# EAGLE design MotorDriver (EAGLE 6.0)
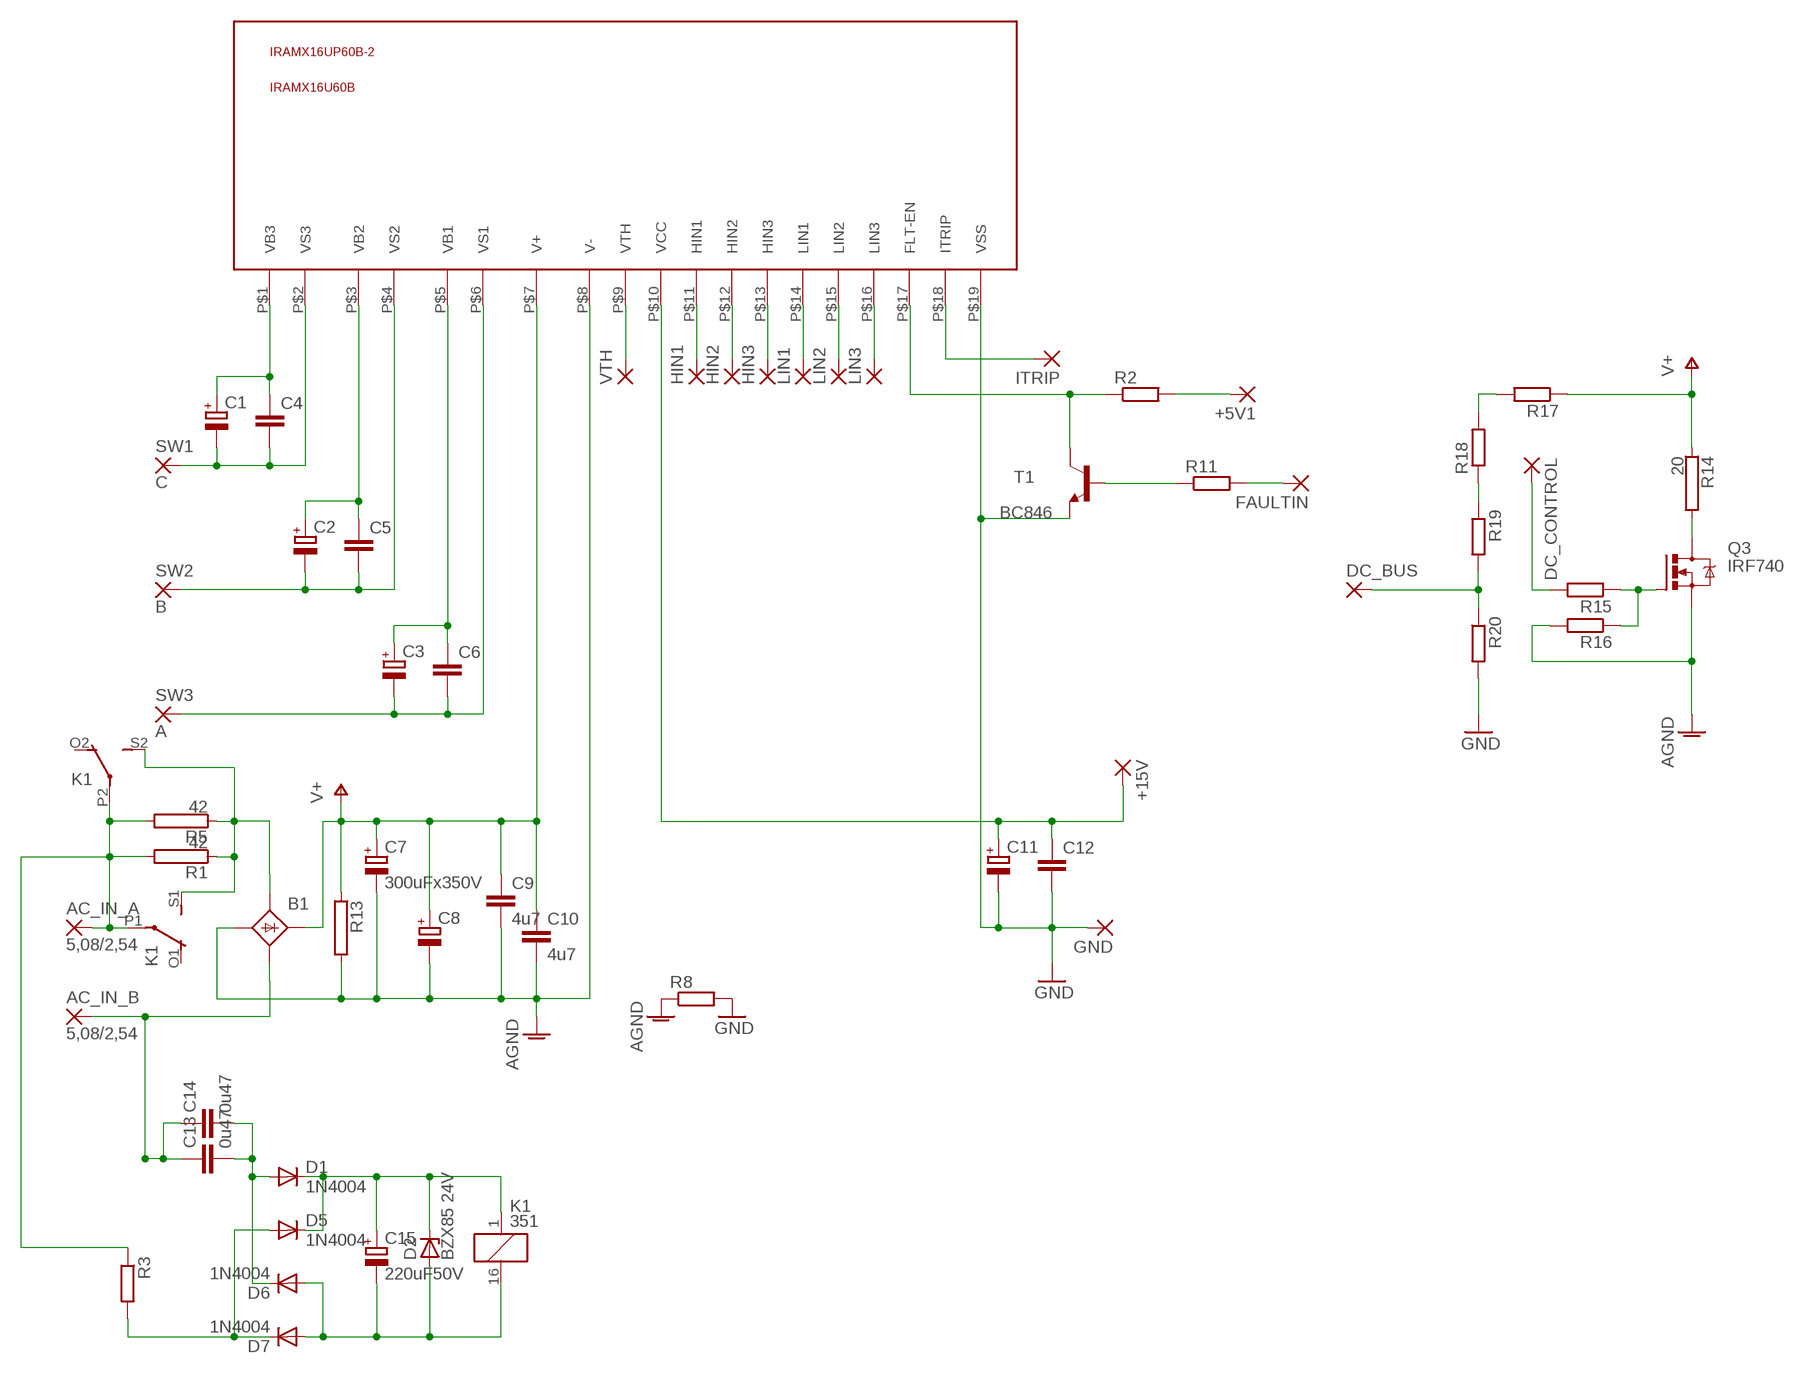
[diagram p0: schematic, sheet 1]

## Parts
+5V1  3,81/1,3  [3,81/1,3]
+15V  3,81/1,3  [3,81/1,3]
AC_IN_A  5,08/2,54  [5,08/2,54]
AC_IN_B  5,08/2,54  [5,08/2,54]
B1  B25A-  [B25A-]
C1  CPOL-EUE2,5-6E  [E2,5-6E]
C2  CPOL-EUE2,5-6E  [E2,5-6E]
C3  CPOL-EUE2,5-6E  [E2,5-6E]
C4  C-EUC1206  [C1206]
C5  C-EUC1206  [C1206]
C6  C-EUC1206  [C1206]
C7  300uFx350V  CPOL-EUE10-35  [EB35D]
C8  CPOL-EUE10-35  [EB35D]
C9  4u7  C-EU225-074X268  [C225-074X268]
C10  4u7  C-EU225-074X268  [C225-074X268]
C11  CPOL-EUE2,5-6E  [E2,5-6E]
C12  C-EUC1206  [C1206]
C13  0u47  C-EU102-064X133  [C102-064X133]
C14  0u47  C-EU102-064X133  [C102-064X133]
C15  220uF50V  CPOL-EUE3.5-10  [E3,5-10]
D1  1N4004  [DO41-10]
D2  BZX85 24V  BZX85  [DO41Z10]
D5  1N4004  [DO41-10]
D6  1N4004  [DO41-10]
D7  1N4004  [DO41-10]
DC_BUS  3,81/1,3  [3,81/1,3]
DC_CONTROL  3,81/1,3  [3,81/1,3]
FAULTIN  3,81/1,3  [3,81/1,3]
GND  3,81/1,3  [3,81/1,3]
HIN1  2,54/0,8  [2,54/0,8]
HIN2  2,54/0,8  [2,54/0,8]
HIN3  2,54/0,8  [2,54/0,8]
IC1  IRAMX16UP60B-2  [SIP2]
ITRIP  2,54/0,8  [2,54/0,8]
K1  351  [351]
LIN1  2,54/0,8  [2,54/0,8]
LIN2  2,54/0,8  [2,54/0,8]
LIN3  2,54/0,8  [2,54/0,8]
Q3  IRF740  [TO220BV]
R1  42  RAC05  [AC05]
R2  R-EU_0204/7  [0204/7]
R3  R-EU_0204/7  [0204/7]
R5  42  RAC05  [AC05]
R8  R-EU_0204/7  [0204/7]
R11  R-EU_0204/7  [0204/7]
R13  RAC04  [AC04]
R14  20  RAC05  [AC05]
R15  R-EU_0204/7  [0204/7]
R16  R-EU_0204/7  [0204/7]
R17  R-EU_0204/7  [0204/7]
R18  R-EU_0204/7  [0204/7]
R19  R-EU_0204/7  [0204/7]
R20  R-EU_0204/7  [0204/7]
SW1  C  5,08/2,54  [5,08/2,54]
SW2  B  5,08/2,54  [5,08/2,54]
SW3  A  5,08/2,54  [5,08/2,54]
T1  BC846  [SOT23]
VTH  2,54/0,8  [2,54/0,8]

## Nets
AGND [power]: B1.- B1.-1(-) C7.- C8.- C9.2 C10.2 IC1.P$8(V-) Q3.S R8.1 R13.2 R16.2
GND: C11.- C12.2 GND.1(P) IC1.P$19(VSS) R8.2 R20.2 T1.2(E)
N$1: C1.+ C4.1 IC1.P$1(VB3)
N$2: C2.+ C5.1 IC1.P$3(VB2)
N$3: C3.+ C6.1 IC1.P$5(VB1)
N$4 [AC Out]: C1.- C4.2 IC1.P$2(VS3) SW1.P$1(P)
N$5 [AC Out]: C2.- C5.2 IC1.P$4(VS2) SW2.P$1(P)
N$6 [AC Out]: C3.- C6.2 IC1.P$6(VS1) SW3.P$1(P)
N$7: IC1.P$9(VTH) VTH.1(P)
N$9 [AC Power]: AC_IN_A.P$1(P) K1.P1(2:P) K1.P2(3:P) R1.2 R3.1 R5.2
N$10 [power]: Q3.D R14.2
N$11: IC1.P$18(ITRIP) ITRIP.1(P)
N$12: R11.1 T1.1(B)
N$13: IC1.P$16(LIN3) LIN3.1(P)
N$14: FAULTIN.1(P) R11.2
N$15: IC1.P$17(FLT-EN) R2.1 T1.3(C)
N$16: IC1.P$15(LIN2) LIN2.1(P)
N$17: IC1.P$14(LIN1) LIN1.1(P)
N$18: HIN3.1(P) IC1.P$13(HIN3)
N$19: HIN2.1(P) IC1.P$12(HIN2)
N$20: HIN1.1(P) IC1.P$11(HIN1)
N$21 [power]: C13.2 C14.2 D1.A D6.C
N$22 [power]: D5.A D7.C R3.2
N$23: DC_CONTROL.1(P) R15.2
N$25: Q3.G R15.1 R16.1
N$27 [AC Power]: B1.AC1 B1.AC1-(AC1) K1.S1(2:S) K1.S2(3:S) R1.1 R5.1
N$28: DC_BUS.1(P) R19.2 R20.1
N$29: +15V.1(P) C11.+ C12.1 IC1.P$10(VCC)
N$31 [power]: C15.- D2.A D6.A D7.A K1.16
N$32 [power]: C15.+ D1.C D2.C D5.C K1.1
N$33: +5V1.1(P) R2.2
N$34: R17.2 R18.2
N$37 [power]: AC_IN_B.P$1(P) B1.AC2 B1.AC2-(AC2) C13.1 C14.1
N$38: R18.1 R19.1
V+ [power]: B1.+ B1.+1(+) C7.+ C8.+ C9.1 C10.1 IC1.P$7(V+) R13.1 R14.1 R17.1
Unconnected: K1.O1(2:O) K1.O2(3:O)

## Library data of the parts
+5V1 +15V DC_BUS DC_CONTROL FAULTIN GND = wirepad:3,81/1,3: THROUGH-HOLE PAD
AC_IN_A AC_IN_B SW1-SW3 = wirepad:5,08/2,54
B1 = rectifier:B25A-: RECTIFIER 25-A bridge
C1-C3 C7 C8 C11 C15 = rcl:CPOL-EU: POLARIZED CAPACITOR, European symbol
C4-C6 C9 C10 C12-C14 = rcl:C-EU: CAPACITOR, European symbol
D1 D5-D7 = diode:1N4004: DIODE general purpose rectifier, 1 A
D2 = diode:BZX85: Z DIODE
HIN1-HIN3 ITRIP LIN1-LIN3 VTH = wirepad:2,54/0,8: THROUGH-HOLE PAD
IC1 = ir:IRAMX16UP60B-2
K1 = relay:351: RELAY 2 x switch, Omron
Q3 = transistor-power:IRF740: N-CHANNEL MOS FET
R1 R5 R13 R14 = resistor-power:R: Power Resitor
R2 R3 R8 R11 R15-R20 = rcl:R-EU_: RESISTOR, European symbol
T1 = transistor:BC846: NPN TRANSISTOR

## Net classes
0 default: width 0.508 mm, drill 0.254 mm, clearance 0.254 mm
1 power: width 1.524 mm, drill 0.254 mm, clearance 0.508 mm
2 AC Power: width 3.048 mm, drill 0.254 mm, clearance 0.508 mm
3 AC Out: width 2.032 mm, clearance 0.508 mm

## Board
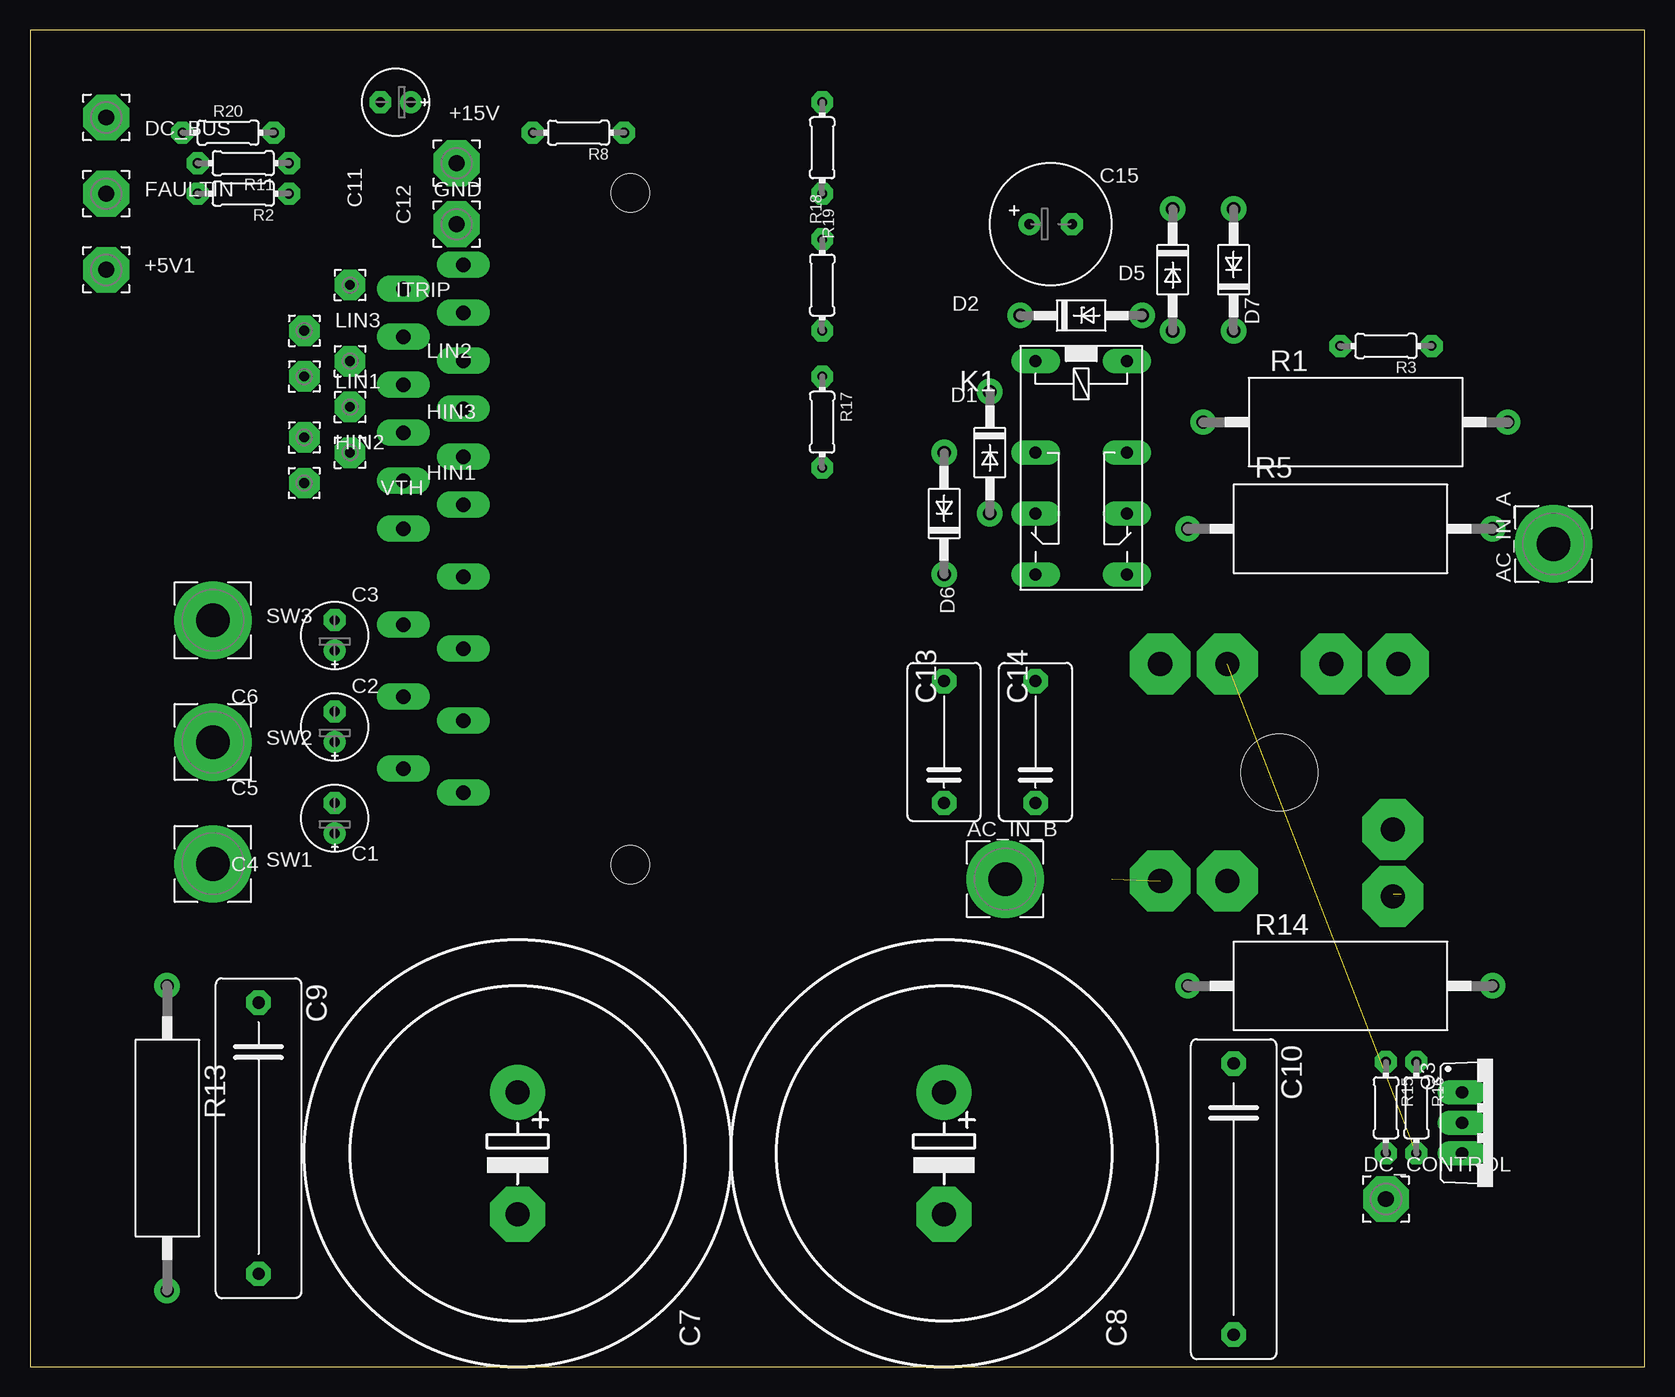
[diagram p1: board, top side]
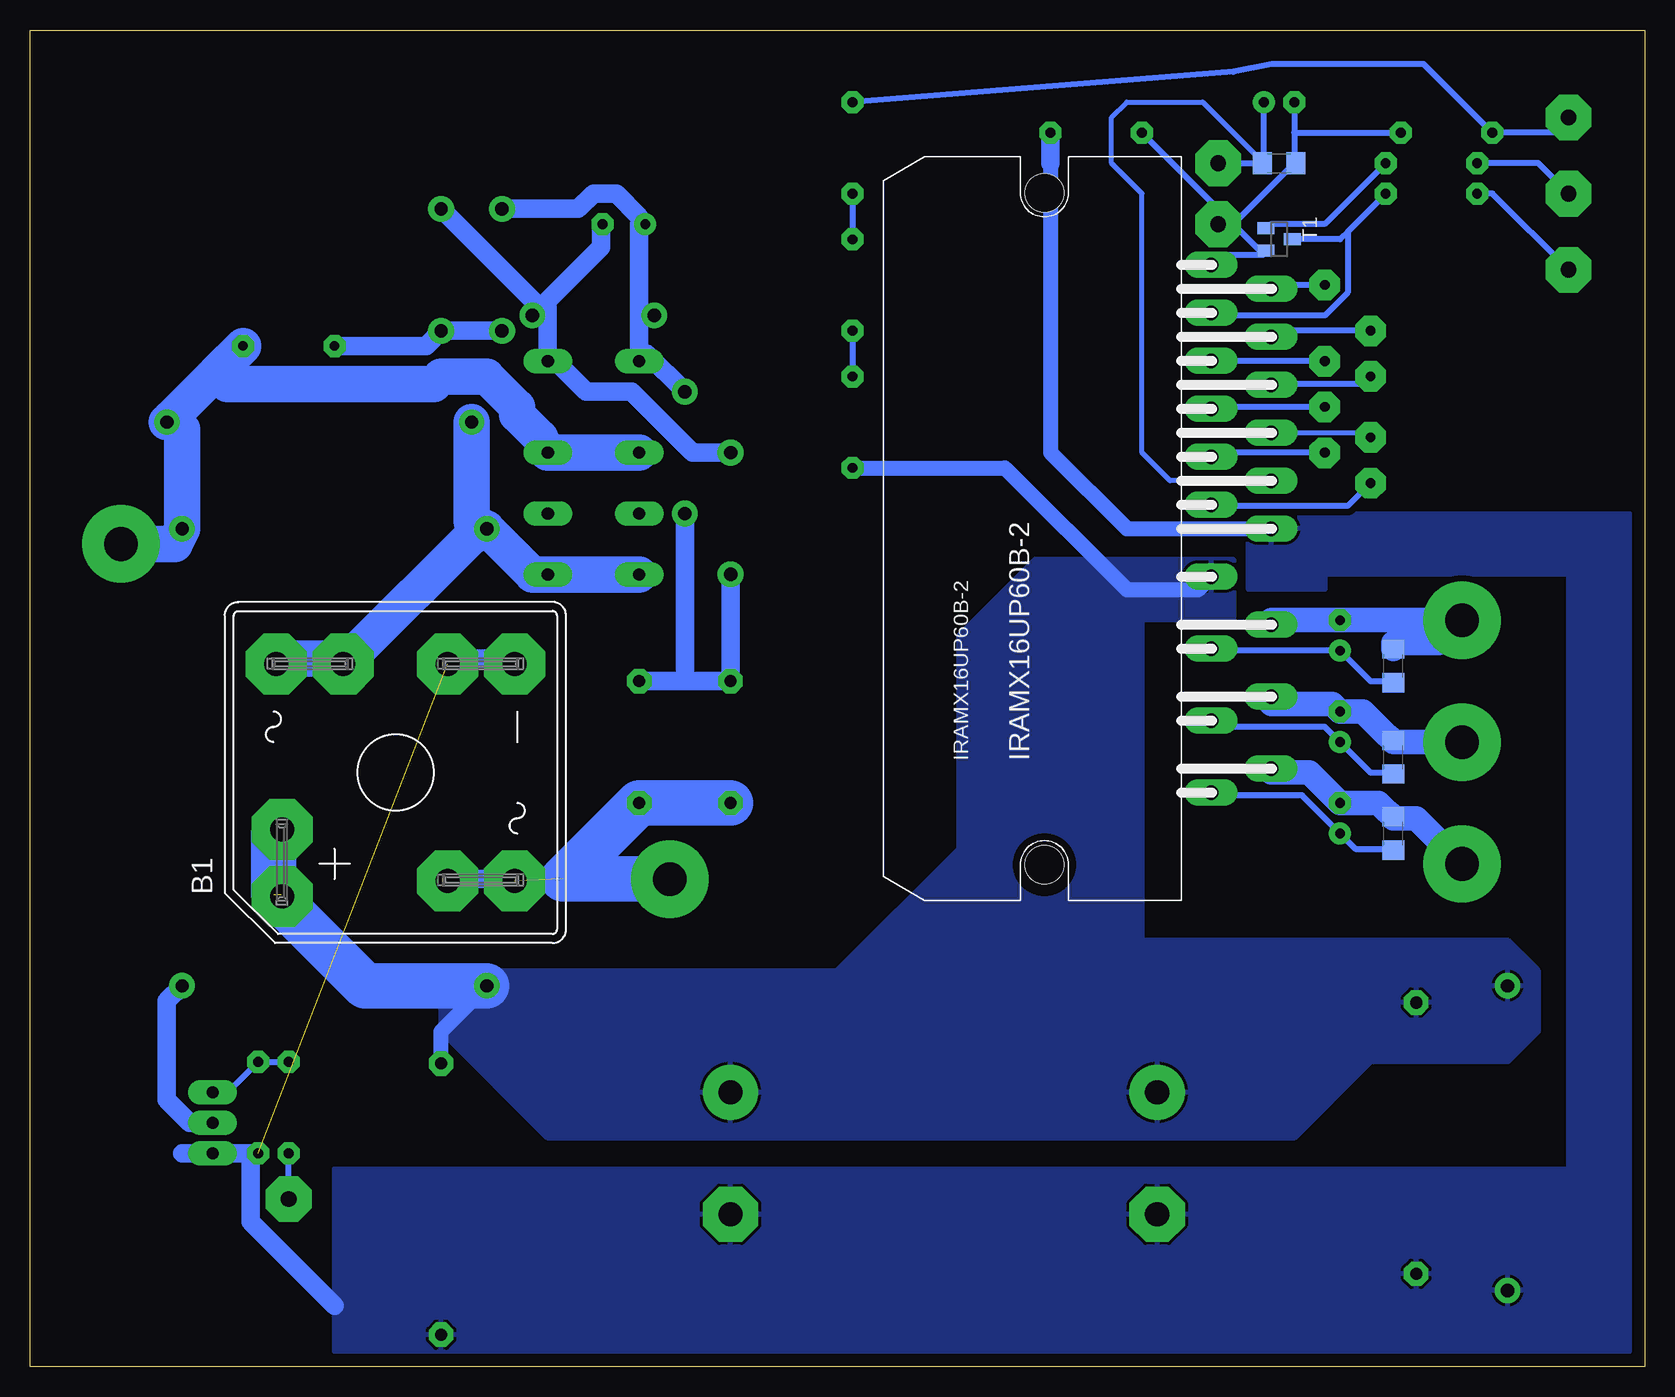
[diagram p2: board, bottom side, seen from below]

Size 134.6 x 111.43 mm. Coordinates in mm from the lower left corner, seen from the top.
Outline: 0,0 134.6,0 134.6,111.43 0,111.43 0,0
Copper layers (1*16): Top 0.035mm / dielectric 1.5mm / Bottom 0.035mm
Design rules: minimum track width 10mil, minimum drill 24mil, track to track 8mil, track to pad 8mil, pad to pad 8mil, via to via 8mil, smd to smd 8mil, copper to edge 40mil, drill to drill 8mil, minimum pad ring 20mil, minimum via ring 8mil, stop-mask expansion 4mil, vias tented up to drill 0mil, thermal gap 10mil

### Footprints (pad centres in the part's own frame; a part is rotated, then mirrored left to right if it is on the bottom)
3,81/1,3 = drill 1.321 pad 3.81 octagon: 1 0,0
5,08/2,54 = drill 2.8 pad 6.452: P$1 0,0
B25A- = drill 2.007 pad 5.08 octagon: + -10.338,9.449; +1 -4.75,9.449; - 9.042,-4.343; -1 9.042,-9.931; AC1 9.042,4.343; AC1- 9.042,9.931; AC2 -9.042,-4.343; AC2- -9.042,-9.931 | hole 6.401: 0,0
E2,5-6E = drill 0.813 pad 1.575: + -1.27,0 | drill 0.813 pad 1.575 octagon: - 1.27,0
C1206 = smd 1.6 x 1.8: 1 -1.4,0; 2 1.4,0
EB35D = drill 2.007 pad 4.597: + -5.08,0 | drill 2.007 pad 4.597 octagon: - 5.08,0
C225-074X268 = drill 1.016 octagon: 1 -11.303,0; 2 11.303,0
C102-064X133 = drill 1.016 octagon: 1 -5.08,0; 2 5.08,0
E3,5-10 = drill 0.813 pad 1.6: + -1.778,0 | drill 0.813 pad 1.6 octagon: - 1.778,0
DO41-10 = drill 1.118: A 5.08,0; C -5.08,0
DO41Z10 = drill 1.118: A 5.08,0; C -5.08,0
2,54/0,8 = drill 0.813 pad 2.54 octagon: 1 0,0
SIP2 = drill 1.2 pad 2.184 long: P$1 -22,-4.5; P$2 -20,-9.5; P$3 -16,-4.5; P$4 -14,-9.5; P$5 -10,-4.5; P$6 -8,-9.5; P$7 -4,-4.5; P$8 0,-9.5; P$9 2,-4.5; P$10 4,-9.5; P$11 6,-4.5; P$12 8,-9.5; P$13 10,-4.5; P$14 12,-9.5; P$15 14,-4.5; P$16 16,-9.5; P$17 18,-4.5; P$18 20,-9.5; P$19 22,-4.5 | hole 3.2: -28,9.4; 28,9.4
351 = drill 1.016 long: 1 -3.81,-3.81; 16 -3.81,3.81; O1 8.89,-3.81; O2 8.89,3.81; P1 3.81,-3.81; P2 3.81,3.81; S1 13.97,-3.81; S2 13.97,3.81
TO220BV = drill 1.016 long: D 0,-2.54; G -2.54,-2.54; S 2.54,-2.54
AC05 = drill 1.1 pad 2: 1 -12.7,0; 2 12.7,0
0204/7 = drill 0.813 octagon: 1 -3.81,0; 2 3.81,0
AC04 = drill 1.1 pad 2: 1 -12.7,0; 2 12.7,0
SOT23 = smd 1 x 1.4: 1 -0.95,-1.1; 2 0.95,-1.1; 3 0,1.1

### Placement (x,y rotation side)
+5V1  6.35,91.44 0 top
+15V  35.56,100.33 90 top
AC_IN_A  127,68.58 90 top
AC_IN_B  81.28,40.64 0 top
B1  104.14,49.53 90 bottom
C1  25.4,45.72 90 top
C2  25.4,53.34 90 top
C3  25.4,60.96 90 top
C4  20.95,44.45 90 bottom
C5  20.95,50.8 90 bottom
C6  20.95,58.42 90 bottom
C7  40.64,17.78 270 top
C8  76.2,17.78 270 top
C9  19.05,19.05 270 top
C10  100.33,13.97 270 top
C11  30.48,105.41 180 top
C12  30.48,100.33 0 bottom
C13  76.2,52.07 90 top
C14  83.82,52.07 90 top
C15  85.09,95.25 0 top
D1  80.01,76.2 270 top
D2  87.63,87.63 0 top
D5  95.25,91.44 270 top
D6  76.2,71.12 90 top
D7  100.33,91.44 90 top
DC_BUS  6.35,104.14 270 top
DC_CONTROL  113.03,13.97 0 top
FAULTIN  6.35,97.79 0 top
GND  35.56,95.25 0 top
HIN1  26.67,76.2 90 top
HIN2  22.86,77.47 90 top
HIN3  26.67,80.01 90 top
IC1  40.64,69.85 90 bottom
ITRIP  26.67,90.17 90 top
K1  87.63,80.01 270 top
LIN1  22.86,82.55 90 top
LIN2  26.67,83.82 90 top
LIN3  22.86,86.36 90 top
Q3  121.92,20.32 270 top
R1  110.49,78.74 0 top
R2  17.78,97.79 180 top
R3  113.03,85.09 180 top
R5  109.22,69.85 0 top
R8  45.72,102.87 180 top
R11  17.78,100.33 180 top
R13  11.43,19.05 270 top
R14  109.22,31.75 0 top
R15  113.03,21.59 270 top
R16  115.57,21.59 270 top
R17  66.04,78.74 90 top
R18  66.04,90.17 270 top
R19  66.04,101.6 90 top
R20  16.51,102.87 0 top
SW1  15.24,41.91 0 top
SW2  15.24,52.07 0 top
SW3  15.24,62.23 0 top
T1  30.48,93.98 270 bottom
VTH  22.86,73.66 270 top

### Tracks (layer width: path | path; a pad name or v marks a point on that pad's centre or on a via)
AGND  (1 unrouted)
  Bottom 1.27: 49.53,100.33 49.53,76.2 43.18,69.85 IC1.P$8
  Bottom 1.524: 109.22,5.08 116.2,12.06 116.2,17.14 R16.2 Q3.S 121.92,17.78 | 49.53,100.33 R8.1 | 93.98,58.42 B1.-1 94.61,59.05 99.69,59.05 B1.-
  pour Bottom: 33.02,64.77 33.02,71.12 1.27,71.12 1.27,1.27 109.22,1.27 109.22,16.51 6.35,16.51 6.35,66.04 26.67,66.04 26.67,64.77
GND
  Bottom 0.508: C11.- 29.21,102.87 | 29.21,102.87 29.21,100.33 | 29.21,102.87 R20.2 | 31.75,92.71 34.92,92.71 35.56,92.08 IC1.P$19 | 31.75,92.71 34.29,95.25 | 34.29,95.25 34.92,95.89 | 34.92,95.89 R8.2 | 31.75,92.71 T1.2 | 34.92,95.89 GND.1 34.29,95.25 | 34.29,95.25 29.21,100.33 | 29.21,100.33 C12.2
N$1
  Bottom 0.508: C4.1 20.95,43.18 24.13,43.18 C1.+ 28.57,47.62 35.56,47.62 IC1.P$1
N$2
  Bottom 0.508: C5.1 20.95,49.53 22.86,49.53 C2.+ 26.67,53.34 35.56,53.34 IC1.P$3
N$3
  Bottom 0.508: C6.1 20.95,57.15 22.86,57.15 C3.+ 35.56,59.69 IC1.P$5
N$4
  Bottom 2.032: SW1.P$1 19.05,45.72 20.95,45.72 C4.2 21.59,46.35 22.23,46.99 C1.- 27.94,49.53 31.11,49.53 IC1.P$2
N$5
  Bottom 2.032: SW2.P$1 20.95,52.07 C5.2 21.59,52.7 23.5,54.61 C2.- 26.04,55.24 31.11,55.24 IC1.P$4
N$6
  Bottom 2.032: IC1.P$6 31.11,62.23 C3.- SW3.P$1 17.14,60.33 20.95,60.33 C6.2
N$7
  Bottom 0.508: VTH.1 24.77,71.75 35.56,71.75 IC1.P$9
N$9
  Bottom 3.048: K1.P1 K1.P2 92.08,77.47 93.98,79.38 93.98,80.01 96.52,82.55 100.33,82.55 100.97,81.92 118.11,81.92 119.06,82.87 | R1.2 122.87,79.06 | 122.87,79.06 119.06,82.87 | 119.06,82.87 R3.1 | 122.87,79.06 121.92,78.11 R5.2 122.56,68.58 AC_IN_A.P$1
N$10
  Bottom 1.524: Q3.D 121.28,20.32 123.19,22.23 123.19,30.48 R14.2
N$11
  Bottom 0.508: ITRIP.1 31.11,90.17 IC1.P$18
N$12
  Bottom 0.508: R11.1 26.67,95.25 31.11,95.25 T1.1
N$13
  Bottom 0.508: LIN3.1 31.11,86.36 IC1.P$16
N$14
  Bottom 0.508: R11.2 8.89,100.33 FAULTIN.1
N$15
  Bottom 0.508: T1.3 25.4,93.98 24.77,94.61 | R2.1 24.77,94.61 | 24.77,94.61 24.77,89.53 26.67,87.63 35.56,87.63 IC1.P$17
N$16
  Bottom 0.508: LIN2.1 35.56,83.82 IC1.P$15
N$17
  Bottom 0.508: LIN1.1 23.5,81.92 31.11,81.92 IC1.P$14
N$18
  Bottom 0.508: HIN3.1 35.56,80.01 IC1.P$13
N$19
  Bottom 0.406: IC1.P$12 22.86,77.85 HIN2.1
N$20
  Bottom 0.508: HIN1.1 35.56,76.2 IC1.P$11
N$21
  Bottom 1.524: C14.2 80.01,57.15 | 80.01,57.15 C13.2 D6.C | 80.01,57.15 D1.A
N$22
  Bottom 1.524: R3.2 101.6,85.09 D7.C D5.A
N$23
  Bottom 0.508: DC_CONTROL.1 R15.2
N$25
  Bottom 0.508: R15.1 R16.1 118.11,22.86 Q3.G
N$27
  Bottom 3.048: B1.AC1- 113.67,59.05 108.58,59.05 B1.AC1 107.31,59.69 97.79,69.22 R5.1 | K1.S1 K1.S2 92.71,66.04 R5.1 | R1.1 97.79,70.48 R5.1
N$28
  Bottom 0.508: DC_BUS.1 7.62,102.87 R20.1 18.41,108.58 31.11,108.58 34.29,107.95 R19.2
N$29
  Bottom 0.406: IC1.P$10 39.56,73.85 41.91,76.2 41.91,97.79 44.45,100.33 44.45,104.14 43.18,105.41 36.83,105.41 31.75,100.33
  Bottom 0.508: +15V.1 C12.1 31.75,100.33 C11.+
N$31
  Bottom 1.524: 92.08,88.27 91.76,88.58 | 91.76,88.58 87,93.34 87,95.25 C15.- | 91.76,88.58 91.44,88.27 K1.16 90.81,83.82 88.27,81.28 84.45,81.28 79.38,76.2 D6.A | 92.08,88.27 D7.A | 92.08,88.27 D2.A
N$32
  Bottom 1.524: 83.82,87.63 K1.1 83.19,84.45 D1.C | 83.82,87.63 83.82,95.25 C15.+ 83.82,95.89 85.72,97.79 87.63,97.79 88.9,96.52 D5.C | D2.C 83.82,87.63
N$33
  Bottom 0.508: R2.2 12.7,97.79 +5V1.1
N$34
  Bottom 0.508: R18.2 R17.2
N$37  (1 unrouted)
  Bottom 1.524: B1.AC2 99.69,40.64 94.61,40.64 B1.AC2-
  Bottom 3.81: AC_IN_B.P$1 90.17,40.64 C14.1 C13.1
N$38
  Bottom 0.508: R19.1 R18.1
V+  (1 unrouted)
  Bottom 1.27: R17.1 53.34,74.93 43.18,64.77 37.22,64.77 IC1.P$7 | C10.1 100.33,27.94 R14.1
  Bottom 1.524: B1.+1 113.67,44.45 113.67,39.37 B1.+
  Bottom 3.81: R14.1 106.68,31.75 114.3,39.37 114.3,44.45
  pour Bottom: 34.29,67.31 34.29,62.23 41.91,62.23 41.91,35.56 11.43,35.56 8.89,33.02 8.89,27.94 11.43,25.4 22.86,25.4 29.21,19.05 91.44,19.05 100.33,27.94 100.33,33.02 67.31,33.02 57.15,43.18 57.15,60.96 50.8,67.31